# EAGLE design placa_datalogger (EAGLE 9.0.1)
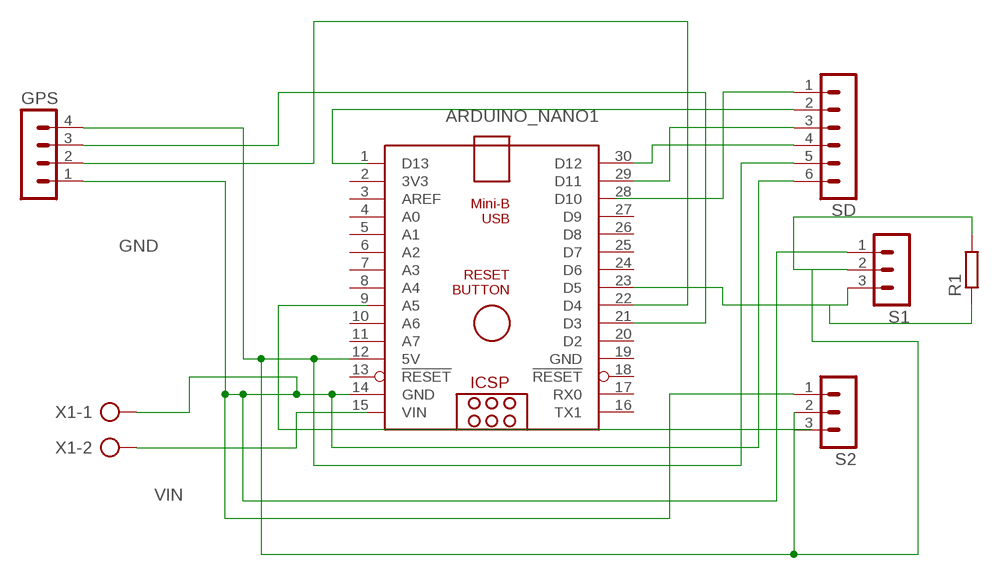
[diagram p0: schematic, sheet 1]

## Parts
ARDUINO_NANO1  ARDUINO_NANO  [ARDUINO_NANO]
GPS  MA04-1  [MA04-1]
R1  R-EU_0204/7  [0204/7]
S1  MA03-1  [MA03-1]
S2  MA03-1  [MA03-1]
SD  MA06-1  [MA06-1]
X1  AK500/2-H  [AK500/2-H]

## Nets
5V: ARDUINO_NANO1.12(5V) GPS.4 R1.2 S1.2 S2.2 SD.5
GND: ARDUINO_NANO1.14(GND) GPS.1 S1.1 S2.1 SD.6 X1.1
N$2: ARDUINO_NANO1.21(D3) GPS.3
N$3: ARDUINO_NANO1.22(D4) GPS.2
N$5: ARDUINO_NANO1.28(D10) SD.1
N$6: SD.2
N$7: ARDUINO_NANO1.29(D11) SD.3
N$8: ARDUINO_NANO1.30(D12) SD.4
N$9: ARDUINO_NANO1.23(D5) R1.1 S1.3
VIN: X1.2
Unconnected: ARDUINO_NANO1.1(D13) ARDUINO_NANO1.2(3V3) ARDUINO_NANO1.3(AREF) ARDUINO_NANO1.4(A0) ARDUINO_NANO1.5(A1) ARDUINO_NANO1.6(A2) ARDUINO_NANO1.7(A3) ARDUINO_NANO1.8(A4) ARDUINO_NANO1.9(A5) ARDUINO_NANO1.10(A6) ARDUINO_NANO1.11(A7) ARDUINO_NANO1.13(!RESET) ARDUINO_NANO1.16(TX1) ARDUINO_NANO1.17(RX0) ARDUINO_NANO1.18(!RESET) ARDUINO_NANO1.20(D2) ARDUINO_NANO1.24(D6) ARDUINO_NANO1.25(D7) ARDUINO_NANO1.26(D8) ARDUINO_NANO1.27(D9) S2.3

## Power pins joined to a net without a drawn wire
GND: ARDUINO_NANO1.19(GND)
VIN: ARDUINO_NANO1.15(VIN)

## Library data of the parts
ARDUINO_NANO1 = ArduinoNanoV30:ARDUINO_NANO: Arduino Nano V3.0 Overview: The Arduino Nano is a small, complete, and breadboard-friendly board based on the ATmega328 (Arduino Nano 3.x) or ATmega168 (Arduino Nano 2.x). It has more or less the same functionality of the Arduino Duemilanove, but in a different package. It lacks only a DC power jack, and works with a Mini-B USB cable instead of a standard one. The Nano was designed and is being produced by Gravitech. Specifications: Microcontroller Atmel ATmega168 or ATmega328 Operating Voltage (logic level) 5 V Input Voltage (recommended) 7-12 V Input Voltage (limits) 6-20 V Digital I/O Pins 14 (of which 6 provide PWM output) Analog Input Pins 8 DC Current per I/O Pin 40 mA Flash Memory 16 KB (ATmega168) or 32 KB (ATmega328) of which 2 KB used by bootloader SRAM 1 KB (ATmega168) or 2 KB (ATmega328) EEPROM 512 bytes (ATmega168) or 1 KB (ATmega328) Clock Speed 16 MHz Dimensions 0.73" x 1.70" Length 45 mm Width 18 mm Weigth 5 g Power: The Arduino Nano can be powered via the Mini-B USB connection, 6-20V unregulated external power supply (pin 30), or 5V regulated external power supply (pin 27). The power source is automatically selected to the highest voltage source. Memory: The ATmega168 has 16 KB of flash memory for storing code (of which 2 KB is used for the bootloader); the ATmega328 has 32 KB, (also with 2 KB used for the bootloader). The ATmega168 has 1 KB of SRAM and 512 bytes of EEPROM (which can be read and written with the EEPROM library); the ATmega328 has 2 KB of SRAM and 1 KB of EEPROM. Input and Output: Each of the 14 digital pins on the Nano can be used as an input or output, using pinMode(), digitalWrite(), and digitalRead() functions. They operate at 5 volts. Each pin can provide or receive a maximum of 40 mA and has an internal pull-up resistor (disconnected by default) of 20-50 kOhms. In addition, some pins have specialized functions. Visit Arduino - ArduinoBoardNano <https://www.arduino.cc/en/Main/ArduinoBoardNano>
GPS = con-lstb:MA04-1: PIN HEADER; OC_FARNELL: unknown; OC_NEWARK: unknown
R1 = rcl:R-EU_: RESISTOR, European symbol; SPICEPREFIX: R
S1 S2 = con-lstb:MA03-1: PIN HEADER; OC_FARNELL: unknown; OC_NEWARK: unknown
SD = con-lstb:MA06-1: PIN HEADER; OC_FARNELL: unknown; OC_NEWARK: unknown
X1 = con-ptr500:AK500/2-H: CONNECTOR Aug. 2004 / PTR Meßtechnik: Die Bezeichnung der Serie AK505 wurde geändert. Es handelt sich hierbei um AK500 in horizontaler Ausführung.; OC_FARNELL: unknown; OC_NEWARK: unknown

## Board
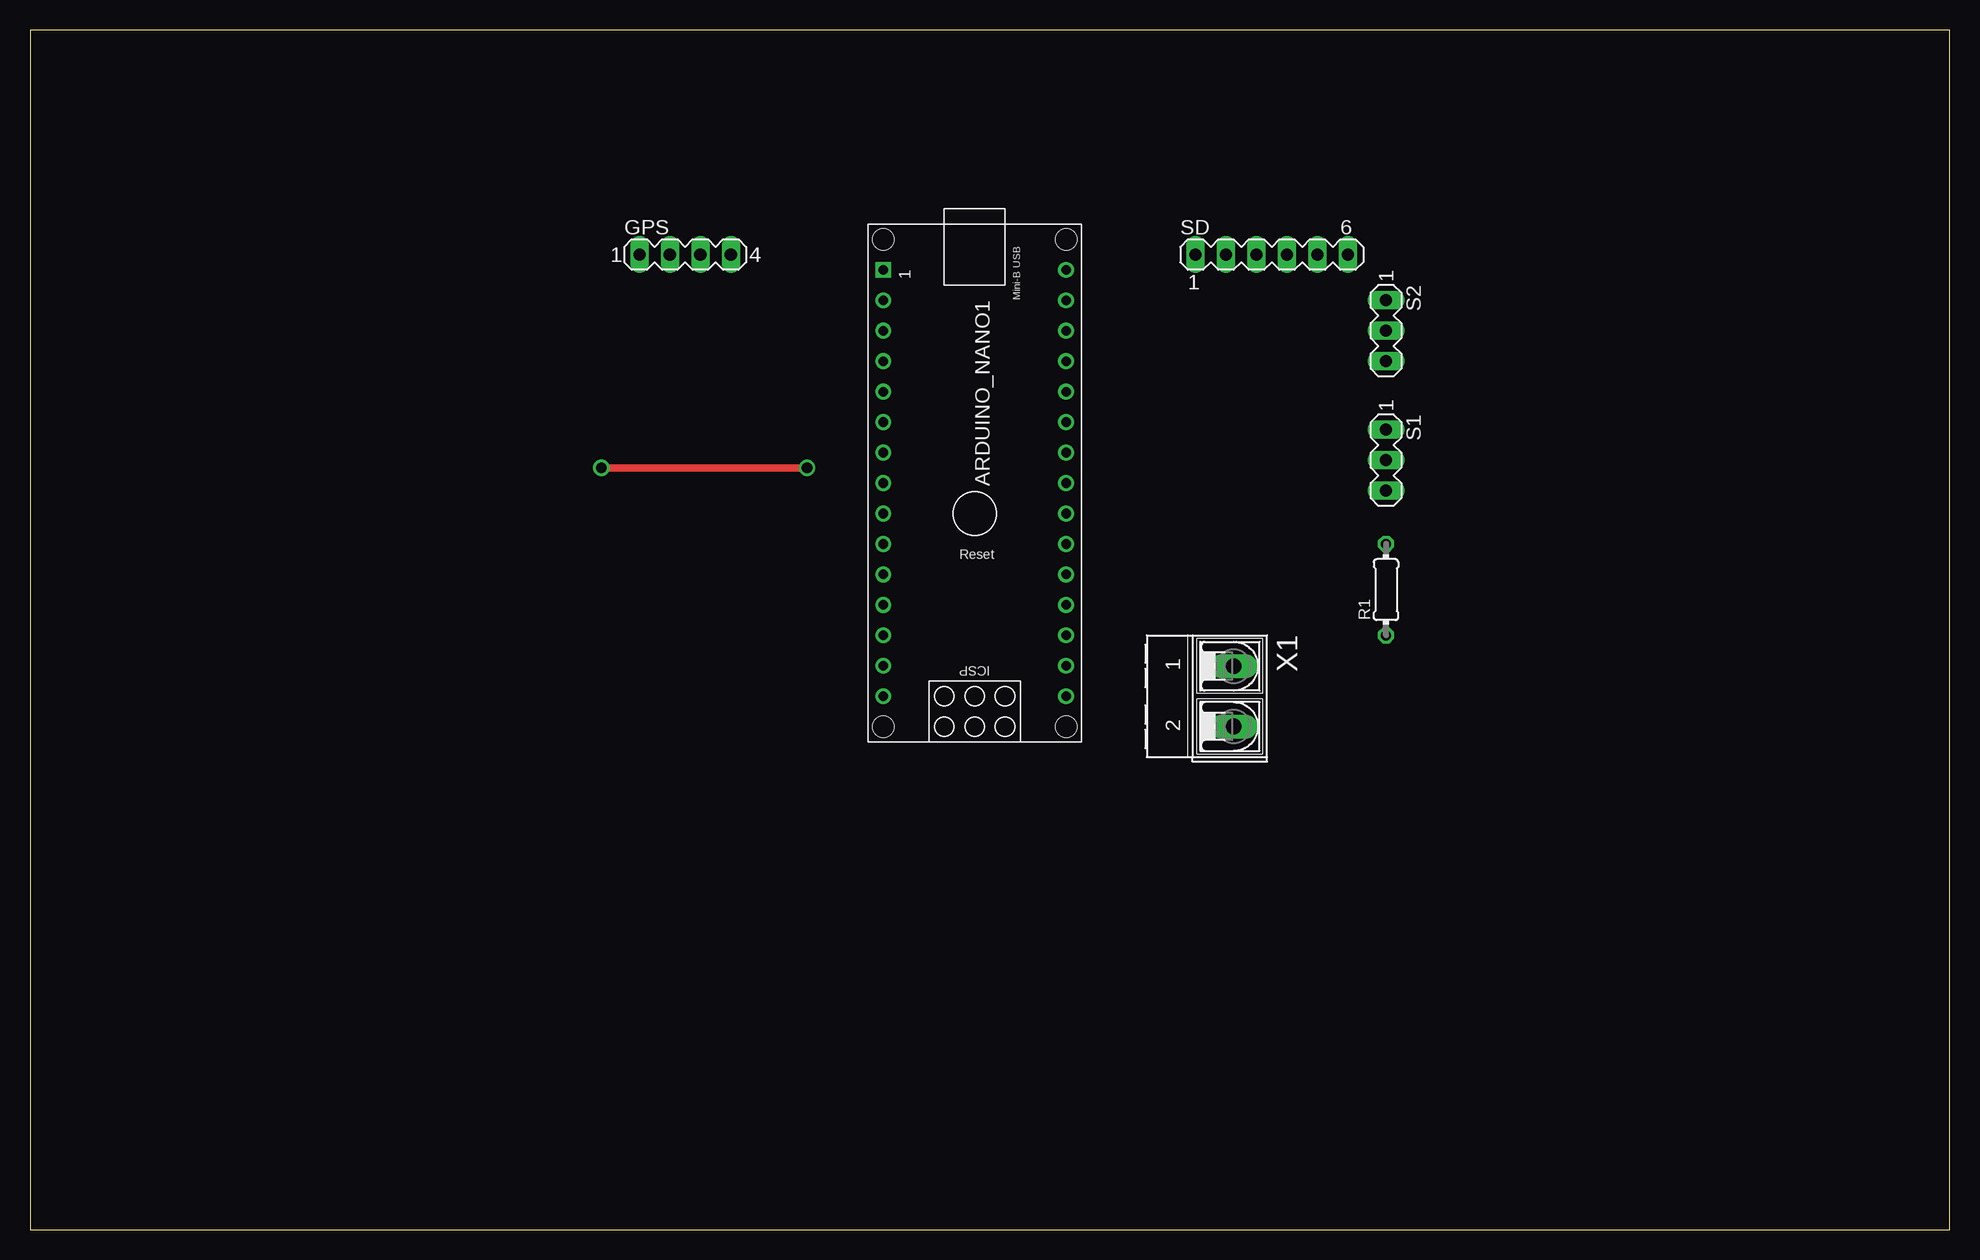
[diagram p1: board, top side]
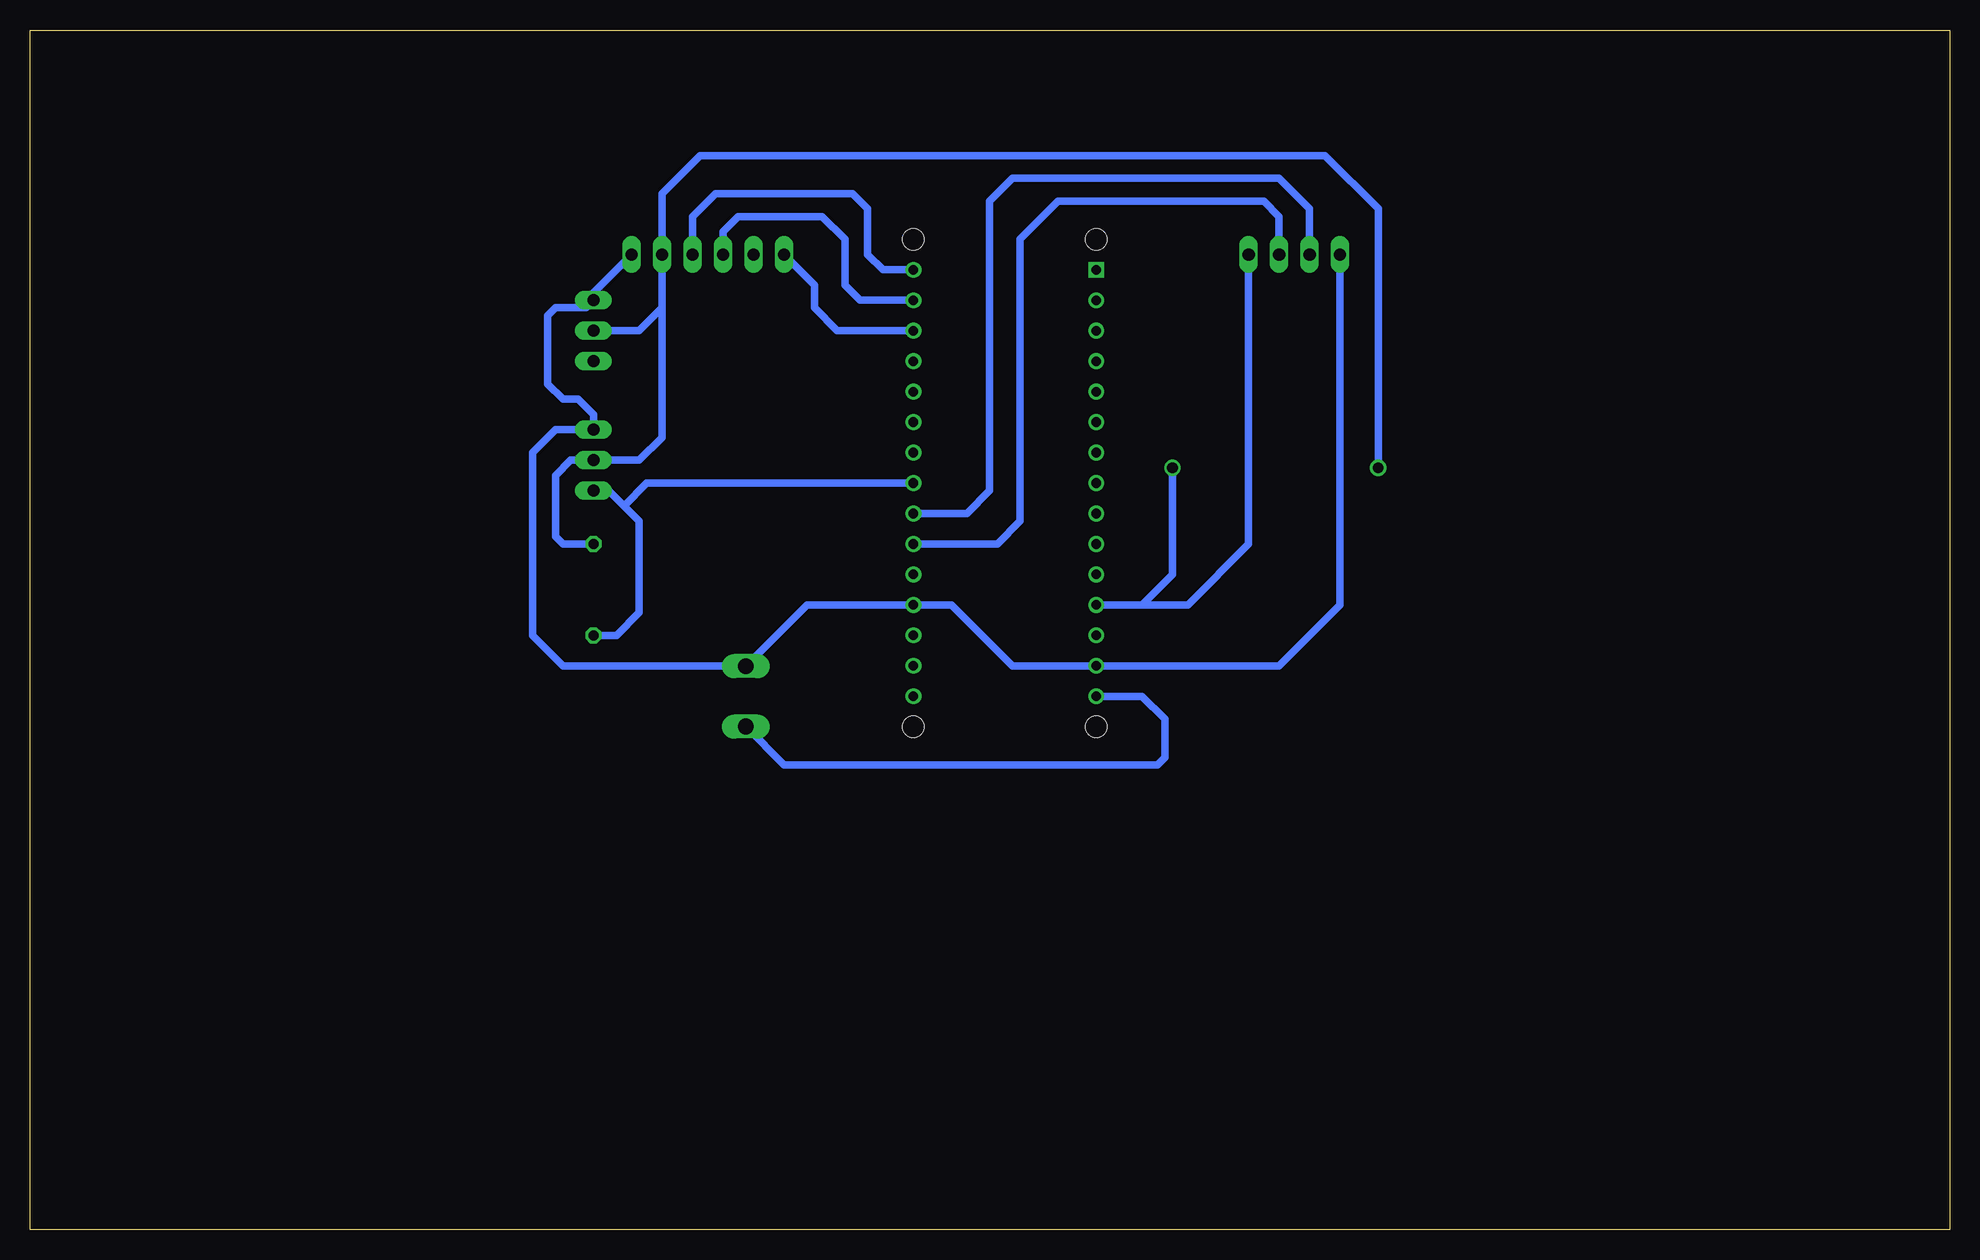
[diagram p2: board, bottom side, seen from below]

Size 160 x 100 mm. Coordinates in mm from the lower left corner, seen from the top.
Outline: 0,0 160,0 160,100 0,100 0,0
Copper layers (1*16): Top 0.035mm / dielectric 1.5mm / Bottom 0.035mm
Design rules "default": minimum track width 6mil, minimum drill 0.35mm, track to track 6mil, track to pad 6mil, pad to pad 6mil, via to via 6mil, smd to smd 6mil, copper to edge 40mil, drill to drill 6mil, minimum pad ring 10mil, minimum via ring 8mil, stop-mask expansion 4mil, vias tented up to drill 0mil, thermal gap 10mil

### Footprints (pad centres in the part's own frame; a part is rotated, then mirrored left to right if it is on the bottom)
ARDUINO_NANO = drill 0.8 square: 1 -20.32,-7.62 | drill 0.8: 2 -17.78,-7.62; 3 -15.24,-7.62; 4 -12.7,-7.62; 5 -10.16,-7.62; 6 -7.62,-7.62; 7 -5.08,-7.62; 8 -2.54,-7.62; 9 0,-7.62; 10 2.54,-7.62; 11 5.08,-7.62; 12 7.62,-7.62; 13 10.16,-7.62; 14 12.7,-7.62; 15 15.24,-7.62; 16 15.24,7.62; 17 12.7,7.62; 18 10.16,7.62; 19 7.62,7.62; 20 5.08,7.62; 21 2.54,7.62; 22 0,7.62; 23 -2.54,7.62; 24 -5.08,7.62; 25 -7.62,7.62; 26 -10.16,7.62; 27 -12.7,7.62; 28 -15.24,7.62; 29 -17.78,7.62; 30 -20.32,7.62 | hole 1.778: -22.86,-7.62; -22.86,7.62; 17.78,7.62; 17.78,-7.62
MA04-1 = drill 1.016 long: 1 -3.81,0; 2 -1.27,0; 3 1.27,0; 4 3.81,0
0204/7 = drill 0.813 octagon: 1 -3.81,0; 2 3.81,0
MA03-1 = drill 1.016 long: 1 -2.54,0; 2 0,0; 3 2.54,0
MA06-1 = drill 1.016 long: 1 -6.35,0; 2 -3.81,0; 3 -1.27,0; 4 1.27,0; 5 3.81,0; 6 6.35,0
AK500/2-H = drill 1.321 long: 1 -2.515,0; 2 2.515,0

### Placement (x,y rotation side)
ARDUINO_NANO1  78.74,59.69 270 top
GPS  54.61,81.28 0 top
R1  113.03,53.34 90 top
S1  113.03,64.14 270 top
S2  113.03,74.93 270 top
SD  103.5,81.28 0 top
X1  100.33,44.45 270 top

### Tracks (layer width: path | path; a pad name or v marks a point on that pad's centre or on a via)
5V  (via drill 0.91)
  Top 0.635: v47.62,63.5 v64.77,63.5
  Bottom 0.635: GPS.4 58.42,57.15 63.5,52.07 67.31,52.07 | 67.31,52.07 ARDUINO_NANO1.12 | 107.31,76.83 SD.5 107.31,86.36 104.14,89.53 52.07,89.53 47.62,85.09 v47.62,63.5 | S2.2 109.22,74.93 107.31,76.83 | R1.2 115.57,57.15 116.2,57.78 116.2,62.87 114.94,64.14 S1.2 109.22,64.14 107.31,66.04 107.31,76.83 | 67.31,52.07 64.77,54.61 v64.77,63.5
GND
  Bottom 0.635: GPS.1 50.8,52.07 55.88,46.99 ARDUINO_NANO1.14 78.11,46.99 83.19,52.07 ARDUINO_NANO1.19 95.22,52.07 X1.1 115.55,46.97 118.11,49.53 118.11,64.77 116.2,66.67 S1.1 113.03,67.94 114.3,69.22 115.57,69.22 116.84,70.48 116.84,76.2 116.2,76.83 113.67,76.83 S2.1 113.03,78.11 SD.6
N$2
  Bottom 0.635: GPS.3 55.88,84.45 57.15,85.72 74.3,85.72 77.47,82.55 77.47,59.05 79.38,57.15 ARDUINO_NANO1.21
N$3
  Bottom 0.635: GPS.2 53.34,85.09 55.88,87.63 78.11,87.63 80.01,85.72 80.01,61.59 81.92,59.69 ARDUINO_NANO1.22
N$5
  Bottom 0.635: SD.1 94.61,78.74 94.61,76.83 92.71,74.93 ARDUINO_NANO1.28
N$7
  Bottom 0.635: SD.3 102.23,83.19 100.97,84.45 93.98,84.45 92.08,82.55 92.08,78.74 90.81,77.47 ARDUINO_NANO1.29
N$8
  Bottom 0.635: SD.4 104.78,84.45 102.87,86.36 91.44,86.36 90.17,85.09 90.17,81.28 88.9,80.01 ARDUINO_NANO1.30
N$9
  Bottom 0.635: R1.1 111.12,49.53 109.22,51.44 109.22,59.05 110.49,60.33 | S1.3 111.76,61.59 110.49,60.33 | ARDUINO_NANO1.23 108.58,62.23 110.49,60.33
VIN
  Bottom 0.635: X1.2 97.13,38.73 66.04,38.73 65.41,39.37 65.41,42.55 67.31,44.45 ARDUINO_NANO1.15